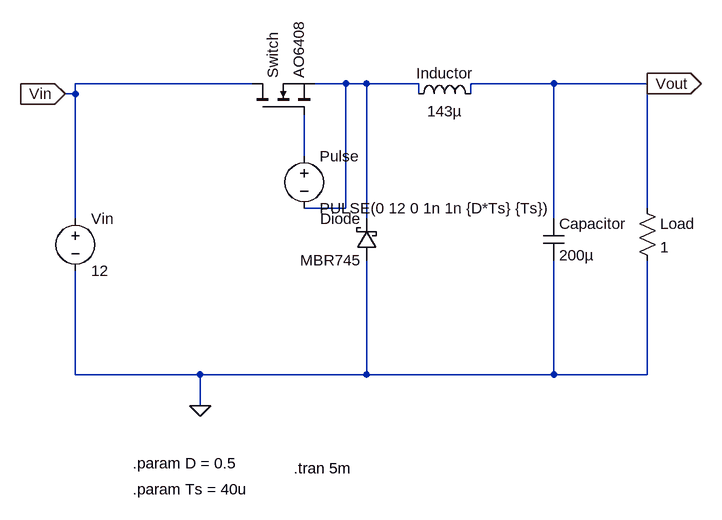
[diagram p0: schematic proj.asc]
proj.asc, the LTspice schematic file:
Version 4
SHEET 1 1024 680
WIRE 304 -80 32 -80
WIRE 448 -80 400 -80
WIRE 480 -80 448 -80
WIRE 560 -80 480 -80
WIRE 768 -80 640 -80
WIRE 912 -80 768 -80
WIRE 32 -64 32 -80
WIRE 32 -64 16 -64
WIRE 560 -64 560 -80
WIRE 640 -64 640 -80
WIRE 384 32 384 -32
WIRE 448 112 448 -80
WIRE 448 112 384 112
WIRE 912 112 912 -80
WIRE 32 128 32 -64
WIRE 480 128 480 -80
WIRE 768 128 768 -80
WIRE 32 368 32 208
WIRE 224 368 32 368
WIRE 480 368 480 192
WIRE 480 368 224 368
WIRE 768 368 768 192
WIRE 768 368 480 368
WIRE 912 368 912 192
WIRE 912 368 768 368
WIRE 224 416 224 368
FLAG 16 -64 Vin
IOPIN 16 -64 In
FLAG 224 416 0
FLAG 912 -80 Vout
IOPIN 912 -80 Out
SYMBOL voltage 32 112 R0
WINDOW 123 0 0 Left 0
WINDOW 39 0 0 Left 0
SYMATTR InstName Vin
SYMATTR Value 12
SYMBOL nmos 304 -32 R270
SYMATTR InstName Switch
SYMATTR Value AO6408
SYMBOL cap 752 128 R0
SYMATTR InstName Capacitor
SYMATTR Value 200µ
SYMATTR SpiceLine Rser=1m
SYMBOL res 896 96 R0
SYMATTR InstName Load
SYMATTR Value 1
SYMBOL ind 544 -48 R270
WINDOW 0 32 56 VTop 2
WINDOW 3 5 56 VBottom 2
SYMATTR InstName Inductor
SYMATTR Value 143µ
SYMATTR SpiceLine Rser=20m
SYMBOL schottky 496 192 R180
WINDOW 0 24 64 Left 2
WINDOW 3 24 0 Left 2
SYMATTR InstName Diode
SYMATTR Value MBR745
SYMATTR Description Diode
SYMATTR Type diode
SYMBOL voltage 384 16 R0
WINDOW 123 0 0 Left 0
WINDOW 39 0 0 Left 0
SYMATTR InstName Pulse
SYMATTR Value PULSE(0 12 0 1n 1n {D*Ts} {Ts})
TEXT 120 504 Left 2 !.param D = 0.5
TEXT 120 544 Left 2 !.param Ts = 40u
TEXT 368 512 Left 2 !.tran 5m

The netlist it stands for:
* proj.asc
Vin Vin 0 12
M§Switch Vin N002 N001 N001 AO6408
Capacitor Vout 0 200µ Rser=1m
R§Load Vout 0 1
L§Inductor N001 Vout 143µ Rser=20m
Diode 0 N001 MBR745
V§Pulse N002 N001 PULSE(0 12 0 1n 1n {D*Ts} {Ts})
.model D D
.lib standard.dio
.model NMOS NMOS
.model PMOS PMOS
.lib standard.mos
.param D = 0.5
.param Ts = 40u
.tran 5m
.backanno
.end